# EasyEDA schematic mega2560_EasyEDA file.json
TITLE: Sheet_1; REV: 1.0; Date: 2026-08-30; Sheet: 1/1; Drawn By: Kelvin Muia; Company: N/A
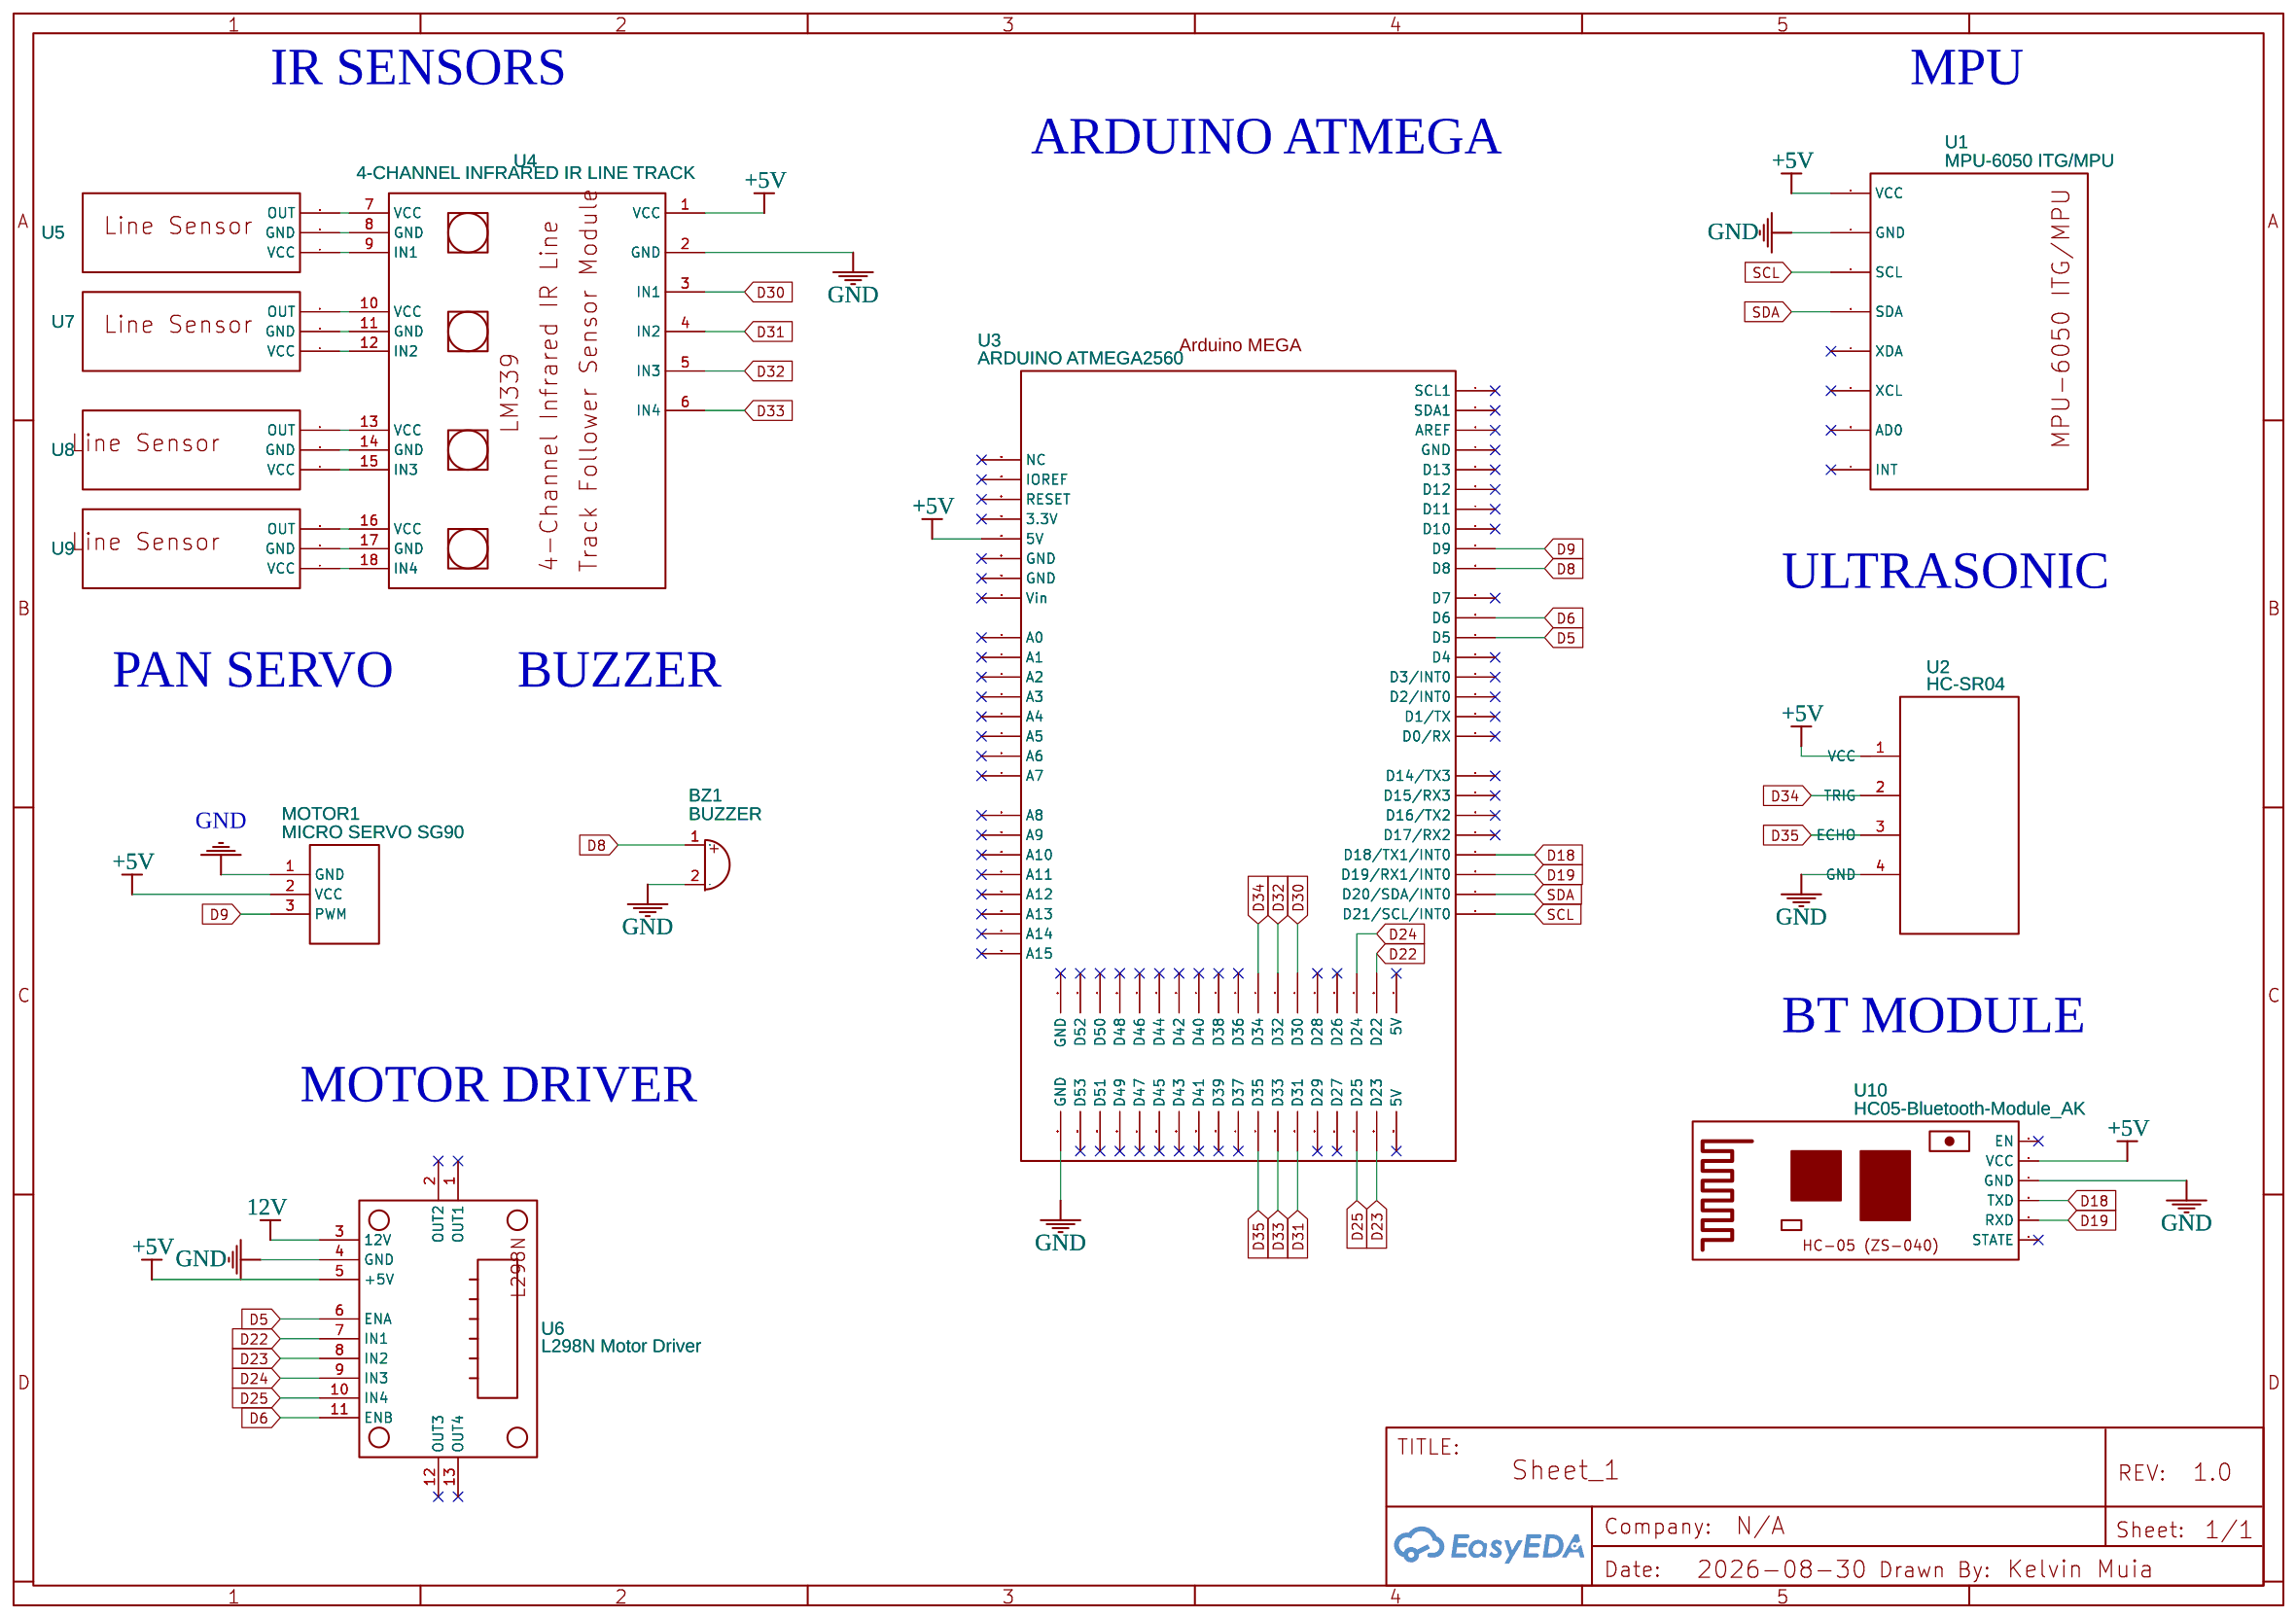
[diagram p0: schematic sheet]

## Parts
BZ1  BUZZER  [BUZZER_BEEPER:BUZZER_9X4MM]
MOTOR1  MICRO SERVO SG90  [MICRO SERVO SG90]
U1  MPU-6050 ITG/MPU  [MPU6050 ITG/MPU]
U2  HC-SR04  [HC_SR04]
U3  ARDUINO ATMEGA2560  [ARDUINO_ATMEGA2560_UFFH]
U4  4-CHANNEL INFRARED IR LINE TRACK  [4-CHANNEL INFRARED IR LINE TRACK FOLLOWER SENSOR MODULE (LM339) COPY]
U5  MH-Sensor-Series Line Sensor  [MH-SENSOR-SERIES-LINE-SENSOR]
U6  L298N Motor Driver  [DRIVER L298N]
U7  MH-Sensor-Series Line Sensor  [MH-SENSOR-SERIES-LINE-SENSOR]
U8  MH-Sensor-Series Line Sensor  [MH-SENSOR-SERIES-LINE-SENSOR]
U9  MH-Sensor-Series Line Sensor  [MH-SENSOR-SERIES-LINE-SENSOR]
U10  HC05-Bluetooth-Module_AK  [HC05-BLUETOOTH-MODULE_AK]

## Library data of the parts
BZ1 = Device_Buzzer: Add into BOM: yes; Convert to PCB: yes; Origin Footprint: Buzzer_Beeper:Buzzer_12x9.5RM7.6; Contributor: jonathanjsuarez
MOTOR1 = MICRO SERVO SG90: Contributor: hoanx.iqqtech
U1 = MPU-6050 ITG/MPU: Supplier: Bangood; Contributor: manarvink
U2 = HC-SR04: Contributor: fernando_l5
U3 = ARDUINO ATMEGA2560: Contributor: uvalnet
U4 = 4-CHANNEL INFRARED IR LINE TRACK FOLLOWER SENSOR MODULE (LM339) COPY: Manufacturer Part: LM339; Contributor: FelixBTG
U5 U7-U9 = MH-Sensor-Series Line Sensor: Contributor: eantis.prod
U6 = L298N Motor Driver: Contributor: Arne Josephus Morales
U10 = HC05-Bluetooth-Module_AK: Contributor: andrej.kanovsky

## Nets
12V: U6.3(12V)
+5V: MOTOR1.2(VCC) U1.0(VCC) U3.82(5V) U4.1(VCC) U6.5(+5V) U10.5(VCC)
GND: BZ1.2(-) MOTOR1.1(GND) U1.1(GND) U3.62(GND) U4.2(GND) U6.4(GND) U10.4(GND)
D5: U3.13(D5) U6.6(ENA)
D6: U3.12(D6) U6.11(ENB)
D8: BZ1.1(+) U3.10(D8)
D9: MOTOR1.3(PWM) U3.9(D9)
D18: U3.23(D18/TX1/INT0) U10.3(TXD)
D19: U3.24(D19/RX1/INT0) U10.2(RXD)
D22: U3.29(D22) U6.7(IN1)
D23: U3.30(D23) U6.8(IN2)
D24: U3.31(D24) U6.9(IN3)
D25: U3.32(D25) U6.10(IN4)
D30: U3.37(D30) U4.3(IN1)
D31: U3.38(D31) U4.4(IN2)
D32: U3.39(D32) U4.5(IN3)
D33: U3.40(D33) U4.6(IN4)
D34: U3.41(D34)
D35: U3.42(D35)
SCL: U1.2(SCL) U3.26(D21/SCL/INT0)
SDA: U1.3(SDA) U3.25(D20/SDA/INT0)
Net-(U4-7): U4.7(VCC) U5.2(OUT)
Net-(U4-8): U4.8(GND) U5.3(GND)
Net-(U4-9): U4.9(IN1) U5.4(VCC)
Net-(U4-10): U4.10(VCC) U7.2(OUT)
Net-(U4-11): U4.11(GND) U7.3(GND)
Net-(U4-12): U4.12(IN2) U7.4(VCC)
Net-(U4-13): U4.13(VCC) U8.2(OUT)
Net-(U4-14): U4.14(GND) U8.3(GND)
Net-(U4-15): U4.15(IN3) U8.4(VCC)
Net-(U4-16): U4.16(VCC) U9.2(OUT)
Net-(U4-17): U4.17(GND) U9.3(GND)
Net-(U4-18): U4.18(IN4) U9.4(VCC)

Not connected (* = marked no-connect by the designer): U1 4(XDA)* 5(XCL)* 6(AD0)* 7(INT)*; U2 1(VCC) 2(TRIG) 3(ECHO) 4(GND); U3 1(SCL1)* 2(SDA1)* 3(AREF)* 4(GND)* 5(D13)* 6(D12)* 7(D11)* 8(D10)* 11(D7)* 14(D4)* 15(D3/INT0)* 16(D2/INT0)* 17(D1/TX)* 18(D0/RX)* 19(D14/TX3)* 20(D15/RX3)* 21(D16/TX2)* 22(D17/RX2)* 27(5V)* 28(5V)* 33(D26)* 34(D27)* 35(D28)* 36(D29)* 43(D36)* 44(D37)* 45(D38)* 46(D39)* 47(D40)* 48(D41)* 49(D42)* 50(D43)* 51(D44)* 52(D45)* 53(D46)* 54(D47)* 55(D48)* 56(D49)* 57(D50)* 58(D51)* 59(D52)* 60(D53)* 61(GND)* 63(A15)* 64(A14)* 65(A13)* 66(A12)* 67(A11)* 68(A10)* 69(A9)* 70(A8)* 71(A7)* 72(A6)* 73(A5)* 74(A4)* 75(A3)* 76(A2)* 77(A1)* 78(A0)* 79(Vin)* 80(GND)* 81(GND)* 83(3.3V)* 84(RESET)* 85(IOREF)* 86(NC)*; U6 1(OUT1)* 2(OUT2)* 12(OUT3)* 13(OUT4)*; U10 1(STATE)* 6(EN)*

## Notes on the sheet
- IR SENSORS
- MPU
- ARDUINO ATMEGA
- ULTRASONIC
- PAN SERVO
- BUZZER
- BT MODULE
- MOTOR DRIVER
